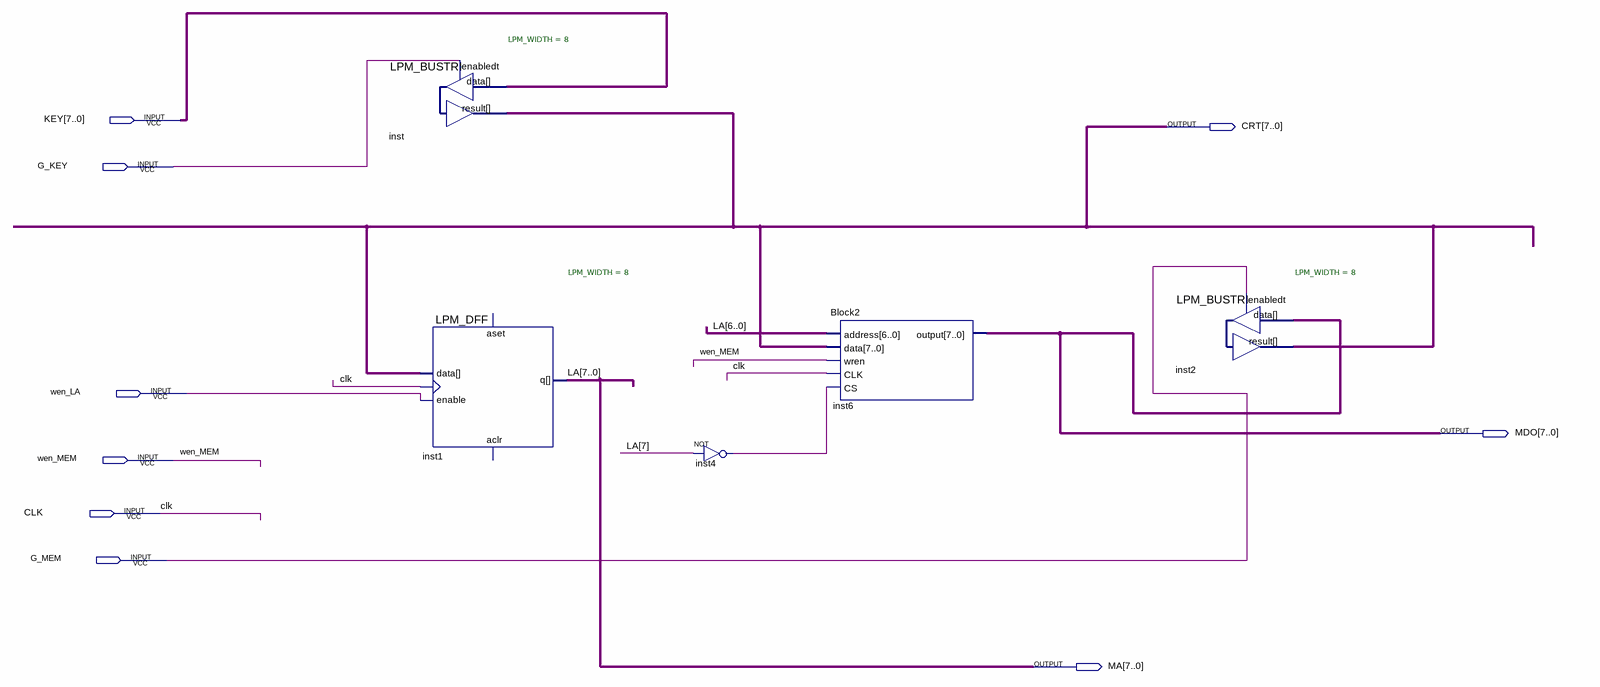
[diagram p0: schematic sheet]
// Quartus schematic MEM.bdf as structural Verilog: 5 symbols, 9 pins
module MEM (
  input  [7:0] KEY,
  input  G_KEY,
  input  wen_LA,
  input  wen_MEM,
  input  CLK,
  input  G_MEM,
  output [7:0] CRT,
  output [7:0] MDO,
  output [7:0] MA
);

  wire inst4_out;

  LPM_BUSTRI #(.LPM_WIDTH(8)) inst (.data(KEY), .enabledt(G_KEY), .result(CRT));
  LPM_DFF #(.LPM_WIDTH(8)) inst1 (.clock(CLK), .data(CRT), .enable(wen_LA), .q(MA));  // open: aclr, aset
  not inst4 (inst4_out, MA[7]);
  Block2 inst6 (.address(MA[6:0]), .data(CRT), .wren(wen_MEM), .CLK(CLK), .CS(inst4_out), .\output (MDO));
  LPM_BUSTRI #(.LPM_WIDTH(8)) inst2 (.data(MDO), .enabledt(G_MEM), .result(CRT));

  // Other names for the same wires on the sheet: LA[7:0] = MA
endmodule
